# EAGLE design dust_environment_sensor (EAGLE 6.4)
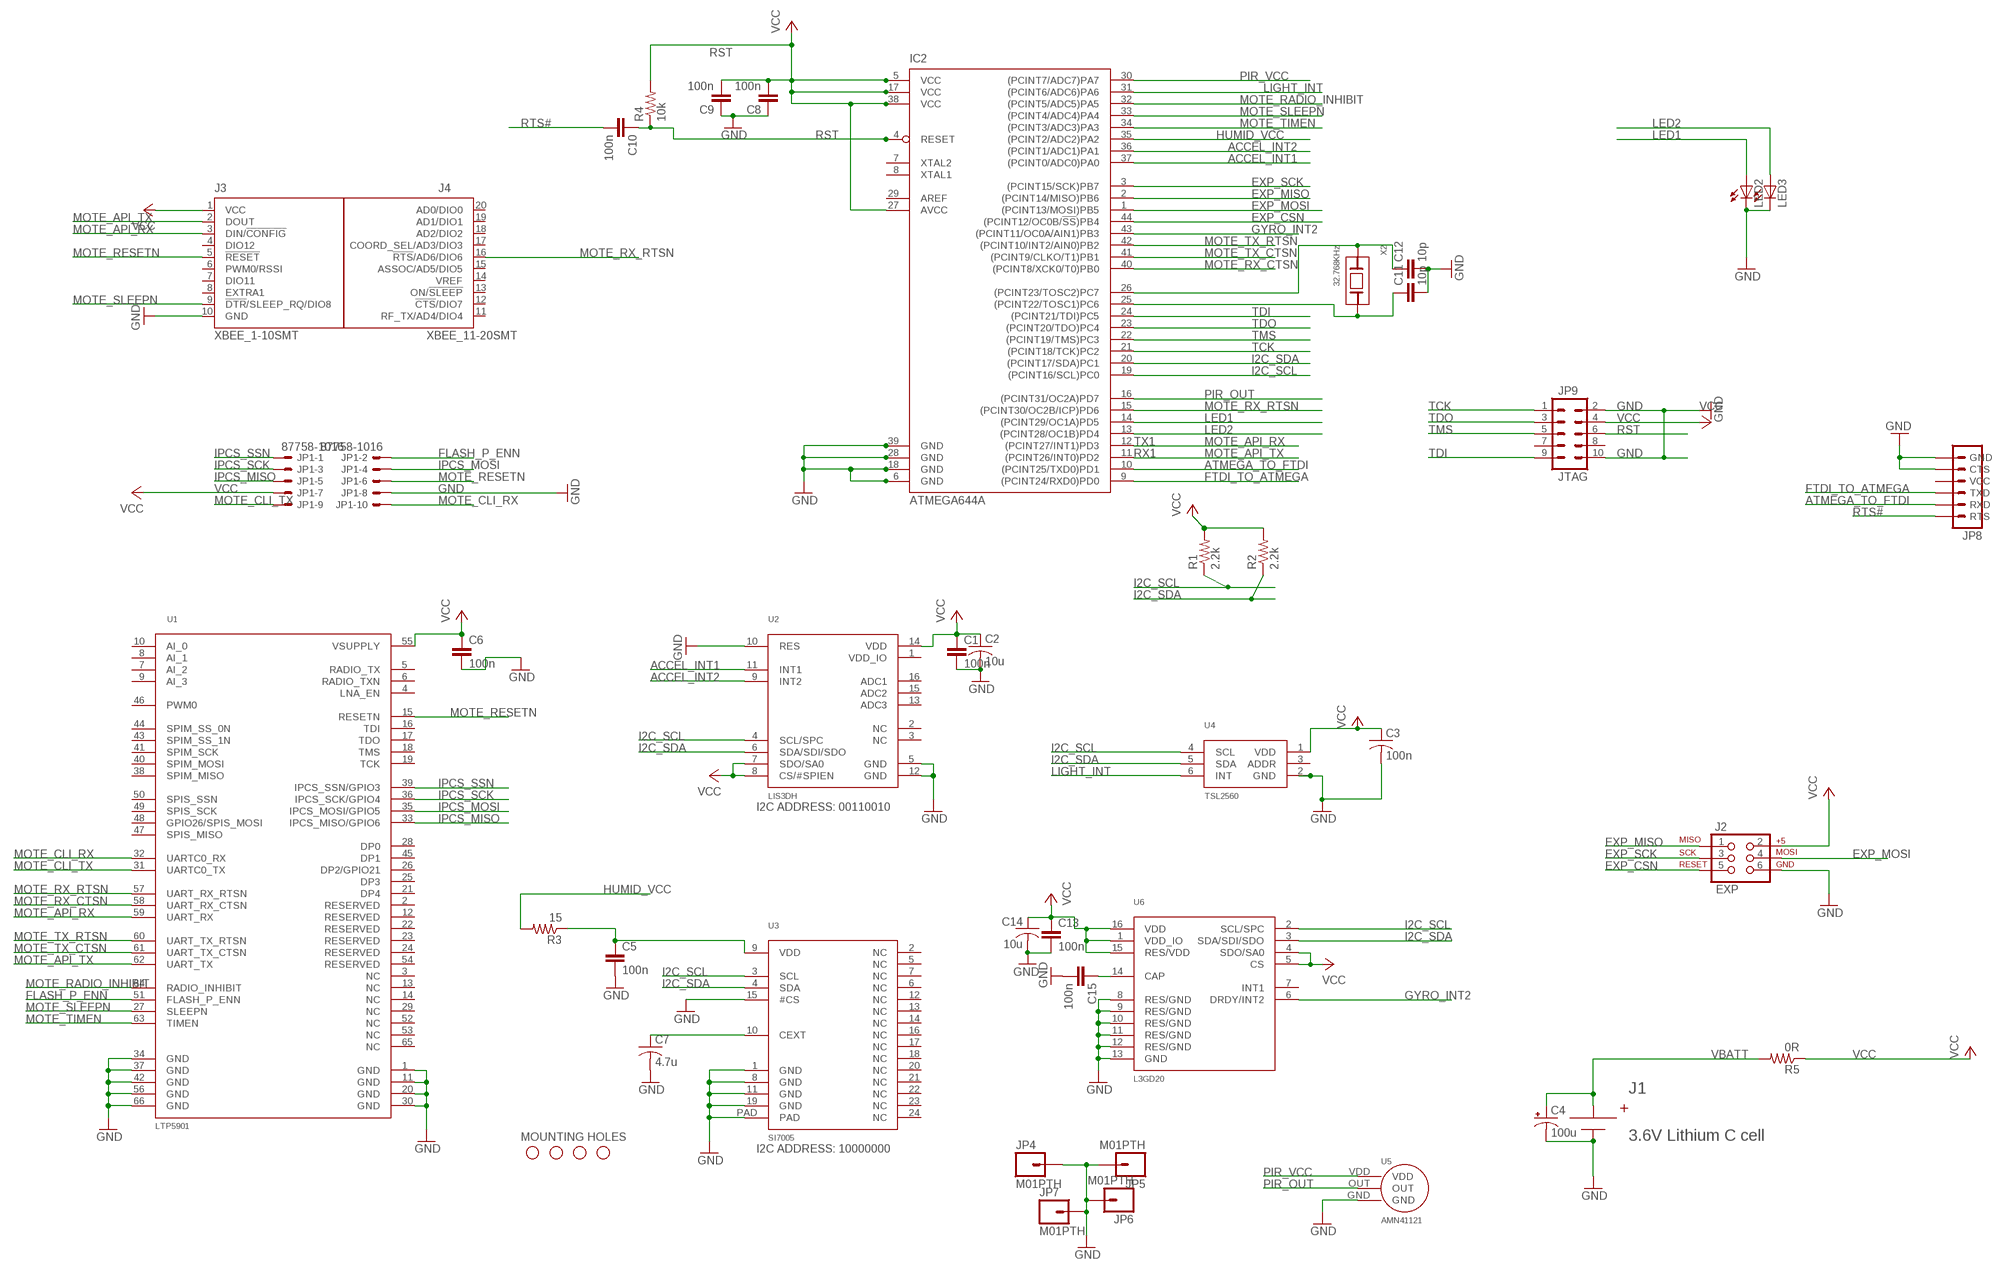
[diagram p0: schematic, sheet 1]

## Parts
C1  100n  C-EUC0603  [C0603]
C2  10u  C-USC0603  [C0603]
C3  100n  C-USC0603  [C0603]
C4  100u  CAP_POL1206-KIT  [EIA3216-KIT]
C5  100n  C-EUC0603  [C0603]
C6  100n  C-EUC0603  [C0603]
C7  4.7u  C-USC0603  [C0603]
C8  100n  C-EUC0603  [C0603]
C9  100n  C-EUC0603  [C0603]
C10  100n  C-EUC0603  [C0603]
C11  10p  C-EUC0603  [C0603]
C12  10p  C-EUC0603  [C0603]
C13  100n  C-EUC0603  [C0603]
C14  10u  C-USC0603  [C0603]
C15  100n  C-EUC0603  [C0603]
IC2  ATMEGA644A  [TQFP44]
J1  3.6V Lithium C cell  BX0036  [BX0036]
J2  EXP  AVR_SPI_PRG_6PTH  [2X3]
J3  XBEE_1-10SMT  [XBEE_1-10_SMT]
J4  XBEE_11-20SMT  [XBEE_11-20_SMT]
JP1  87758-1016  [87758-1016]
JP4  M01PTH  [1X01]
JP5  M01PTH  [1X01]
JP6  M01PTH  [1X01]
JP7  M01PTH  [1X01]
JP8  FTDI_CABLESIP  [1X06]
JP9  JTAG  M05X2PTH  [AVR_ICSP]
LED2  LEDCHIPLED_0805  [CHIPLED_0805]
LED3  LEDCHIPLED_0805  [CHIPLED_0805]
R1  2.2k  R-US_R0603  [R0603]
R2  2.2k  R-US_R0603  [R0603]
R3  15  R-US_R0603  [R0603]
R4  10k  R-US_R0603  [R0603]
R5  0R  R-US_R0603  [R0603]
STANDOFF1  STAND-OFF  [STAND-OFF]
STANDOFF2  STAND-OFF  [STAND-OFF]
STANDOFF3  STAND-OFF  [STAND-OFF]
STANDOFF4  STAND-OFF  [STAND-OFF]
U1  LTP5901  [LTP5901_MODULE]
U2  LIS3DH  [LGA16_ST]
U3  SI7005  [QFN24_SILICON_LABS]
U4  TSL2560  [CL6_TAOS]
U5  AMN41121  [AMN41121]
U6  L3GD20  [LGA16_4X4_ST]
X2  32.768KHz  XTALABS07  [ABS07]

## Nets
ACCEL_INT1: IC2.37((PCINT0/ADC0)PA0) U2.11(INT1)
ACCEL_INT2: IC2.36((PCINT1/ADC1)PA1) U2.9(INT2)
ATMEGA_TO_FTDI: IC2.10((PCINT25/TXD0)PD1) JP8.5(RXD)
EXP_CSN: IC2.44((PCINT12/OC0B/!SS!)PB4) J2.5
EXP_MISO: IC2.2((PCINT14/MISO)PB6) J2.1
EXP_MOSI: IC2.1((PCINT13/MOSI)PB5) J2.4
EXP_SCK: IC2.3((PCINT15/SCK)PB7) J2.3
FLASH_P_ENN: JP1.2 U1.51(FLASH_P_ENN)
FTDI_TO_ATMEGA: IC2.9((PCINT24/RXD0)PD0) JP8.4(TXD)
GND: C1.2 C2.2 C3.2 C4.C(-) C5.2 C6.2 C7.2 C8.1 C9.1 C11.2 C12.2 C13.2 C14.2 C15.2 IC2.6(GND) IC2.18(GND) IC2.28(GND) IC2.39(GND) J1.NEG J2.6 J3.10(GND) JP1.8 JP4.1 JP5.1 JP6.1 JP7.1 JP8.1(GND) JP8.2(CTS) JP9.2 JP9.10 LED2.C LED3.C U1.1(GND) U1.11(GND) U1.20(GND) U1.30(GND) U1.34(GND) U1.37(GND) U1.42(GND) U1.56(GND) U1.66(GND) U2.5(GND) U2.10(RES) U2.12(GND) U3.1(GND) U3.8(GND) U3.11(GND) U3.15(#CS) U3.19(GND) U3.PAD U4.2(GND) U5.GND U6.8(RES/GND) U6.9(RES/GND) U6.10(RES/GND) U6.11(RES/GND) U6.12(RES/GND) U6.13(GND)
GYRO_INT2: IC2.43((PCINT11/OC0A/AIN1)PB3) U6.6(DRDY/INT2)
HUMID_VCC: IC2.35((PCINT2/ADC2)PA2) R3.2
I2C_SCL: IC2.19((PCINT16/SCL)PC0) R1.1 U2.4(SCL/SPC) U3.3(SCL) U4.4(SCL) U6.2(SCL/SPC)
I2C_SDA: IC2.20((PCINT17/SDA)PC1) R2.1 U2.6(SDA/SDI/SDO) U3.4(SDA) U4.5(SDA) U6.3(SDA/SDI/SDO)
IPCS_MISO: JP1.5 U1.33(IPCS_MISO/GPIO6)
IPCS_MOSI: JP1.4 U1.35(IPCS_MOSI/GPIO5)
IPCS_SCK: JP1.3 U1.36(IPCS_SCK/GPIO4)
IPCS_SSN: JP1.1 U1.39(IPCS_SSN/GPIO3)
LED1: IC2.14((PCINT29/OC1A)PD5) LED2.A
LED2: IC2.13((PCINT28/OC1B)PD4) LED3.A
LIGHT_INT: IC2.31((PCINT6/ADC6)PA6) U4.6(INT)
MOTE_API_RX: IC2.12((PCINT27/INT1)PD3) J3.3(DIN/!CONFIG) U1.59(UART_RX)
MOTE_API_TX: IC2.11((PCINT26/INT0)PD2) J3.2(DOUT) U1.62(UART_TX)
MOTE_CLI_RX: JP1.10 U1.32(UARTC0_RX)
MOTE_CLI_TX: JP1.9 U1.31(UARTC0_TX)
MOTE_RADIO_INHIBIT: IC2.32((PCINT5/ADC5)PA5) U1.64(RADIO_INHIBIT)
MOTE_RESETN: J3.5(!RESET) JP1.6 U1.15(RESETN)
MOTE_RX_CTSN: IC2.40((PCINT8/XCK0/T0)PB0) U1.58(UART_RX_CTSN)
MOTE_RX_RTSN: IC2.15((PCINT30/OC2B/ICP)PD6) J4.16(!RTS!/AD6/DIO6) U1.57(UART_RX_RTSN)
MOTE_SLEEPN: IC2.33((PCINT4/ADC4)PA4) J3.9(!DTR!/SLEEP_RQ/DIO8) U1.27(SLEEPN)
MOTE_TIMEN: IC2.34((PCINT3/ADC3)PA3) U1.63(TIMEN)
MOTE_TX_CTSN: IC2.41((PCINT9/CLKO/T1)PB1) U1.61(UART_TX_CTSN)
MOTE_TX_RTSN: IC2.42((PCINT10/INT2/AIN0)PB2) U1.60(UART_TX_RTSN)
N$1: C7.1 U3.10(CEXT)
N$2: C15.1 U6.14(CAP)
N$3: C5.1 R3.1 U3.9(VDD)
N$6: C11.1 IC2.25((PCINT22/TOSC1)PC6) X2.2(B)
N$7: C12.1 IC2.26((PCINT23/TOSC2)PC7) X2.1(A)
PIR_OUT: IC2.16((PCINT31/OC2A)PD7) U5.OUT
PIR_VCC: IC2.30((PCINT7/ADC7)PA7) U5.VDD
RST: C10.1 IC2.4(RESET) JP9.6 R4.1
RTS#: C10.2 JP8.6(RTS)
TCK: IC2.21((PCINT18/TCK)PC2) JP9.1
TDI: IC2.24((PCINT21/TDI)PC5) JP9.9
TDO: IC2.23((PCINT20/TDO)PC4) JP9.3
TMS: IC2.22((PCINT19/TMS)PC3) JP9.5
VBATT: C4.A(+) J1.POS R5.2
VCC: C1.1 C2.1 C3.1 C6.1 C8.2 C9.2 C13.1 C14.1 IC2.5(VCC) IC2.17(VCC) IC2.27(AVCC) IC2.38(VCC) J2.2 J3.1(VCC) JP1.7 JP9.4 R1.2 R2.2 R4.2 R5.1 U1.55(VSUPPLY) U2.7(SDO/SA0) U2.8(CS/#SPIEN) U2.14(VDD) U4.1(VDD) U6.1(VDD_IO) U6.4(SDO/SA0) U6.5(CS) U6.15(RES/VDD) U6.16(VDD)
Unconnected: IC2.7(XTAL2) IC2.8(XTAL1) IC2.29(AREF) J3.4(DIO12) J3.6(PWM0/RSSI) J3.7(DIO11) J3.8(EXTRA1) J4.11(RF_TX/AD4/DIO4) J4.12(!CTS!/DIO7) J4.13(ON/!SLEEP) J4.14(VREF) J4.15(ASSOC/AD5/DIO5) J4.17(COORD_SEL/AD3/DIO3) J4.18(AD2/DIO2) J4.19(AD1/DIO1) J4.20(AD0/DIO0) JP8.3(VCC) JP9.7 JP9.8 U1.2(RESERVED) U1.3(NC) U1.4(LNA_EN) U1.5(RADIO_TX) U1.6(RADIO_TXN) U1.7(AI_2) U1.8(AI_1) U1.9(AI_3) U1.10(AI_0) U1.12(RESERVED) U1.13(NC) U1.14(NC) U1.16(TDI) U1.17(TDO) U1.18(TMS) U1.19(TCK) U1.21(DP4) U1.22(RESERVED) U1.23(RESERVED) U1.24(RESERVED) U1.25(DP3) U1.26(DP2/GPIO21) U1.28(DP0) U1.29(NC) U1.38(SPIM_MISO) U1.40(SPIM_MOSI) U1.41(SPIM_SCK) U1.43(SPIM_SS_1N) U1.44(SPIM_SS_0N) U1.45(DP1) U1.46(PWM0) U1.47(SPIS_MISO) U1.48(GPIO26/SPIS_MOSI) U1.49(SPIS_SCK) U1.50(SPIS_SSN) U1.52(NC) U1.53(NC) U1.54(RESERVED) U1.65(NC) U2.1(VDD_IO) U2.2(NC) U2.3(NC) U2.13(ADC3) U2.15(ADC2) U2.16(ADC1) U3.2(NC) U3.5(NC) U3.6(NC) U3.7(NC) U3.12(NC) U3.13(NC) U3.14(NC) U3.16(NC) U3.17(NC) U3.18(NC) U3.20(NC) U3.21(NC) U3.22(NC) U3.23(NC) U3.24(NC) U4.3(ADDR) U6.7(INT1)

## Notes on the sheet
- TX1
- RX1
- I2C ADDRESS: 00110010
- MOUNTING HOLES
- I2C ADDRESS: 10000000

## Library data of the parts
C1 C5 C6 C8-C13 C15 = rcl:C-EU: CAPACITOR, European symbol
C2 C3 C7 C14 = rcl:C-US: CAPACITOR, American symbol
C4 = SparkFun-Capacitors:CAP_POL: Capacitor Polarized These are standard SMD and PTH capacitors. Normally 10uF, 47uF, and 100uF in electrolytic and tantalum varieties. Always verify the external diameter of the through hole cap, it varies with capacity, voltage, and manufacturer. The EIA devices should be standard.
IC2 = atmel:ATMEGA644: 8-bit Microcontroller with 64K Bytes In-System Programmable Flash Source: http://www.atmel.com/dyn/resources/prod_documents/doc2593.pdf; MPN: ATMEGA644PV-10AU; OC_FARNELL: 1455123; OC_NEWARK: 58M3748
J1 = Cool_Electricity:BX0036: BX0036 C-cell battery holder
J2 = SparkFun-Connectors:AVR_SPI_PRG_6: AVR ISP 6 Pin This is the reduced ISP connector for AVR programming. Common on Arduino. This footprint will take up less PCB space and can be used with a 10-pin to 6-pin adapter such as SKU: BOB-08508
J3 = Cool_Electricity:XBEE_1-10
J4 = Cool_Electricity:XBEE_11-20
JP1 = con-molex:87758-1016: 10 Pin - 2mm Dual Row Single Wafer, Vertical T/H HDR Source: http://www.molex.com/pdm_docs/sd/877580616_sd.pdf; MF: MOLEX; MPN: 87758-1016; OC_FARNELL: 7472340; OC_NEWARK: 59J1558
JP4-JP7 = SparkFun-Connectors:M01: Header 1 Standard 1-pin 0.1" header. Use with straight break away headers (SKU : PRT-00116), right angle break away headers (PRT-00553), swiss pins (PRT-00743), machine pins (PRT-00117), and female headers (PRT-00115).
JP8 = custom:FTDI_CABLE: Header 6 Standard 6-pin 0.1" header. Use with straight break away headers (SKU : PRT-00116), right angle break away headers (PRT-00553), swiss pins (PRT-00743), machine pins (PRT-00117), and female headers (PRT-00115). Molex polarized connector foot print use with SKU : PRT-08094 with associated crimp pins and housings. NOTES ON THE VARIANTS LOCK and LOCK_LONGPADS... This footprint was designed to help hold the alignment of a through-hole component (i.e. 6-pin header) while soldering it into place. You may notice that each hole has been shifted either up or down by 0.005 of an inch from it's more standard position (which is a perfectly straight line). This slight alteration caused the pins (the squares in the middle) to touch the edges of the holes. Because they are alternating, it causes a "brace" to hold the component in place. 0.005 has proven to be the perfect amount of "off-center" position when using our standard breakaway headers. Although looks a little odd when you look at the bare footprint, once you have a header in there, the alteration is very hard to notice. Also, if you push a header all the way into place, it is covered up entirely on the bottom side. This idea of altering the position of holes to aid alignment will be further integrated into the Sparkfun Library for other footprints. It can help hold any component with 3 or more connection pins.
JP9 = SparkFun-Connectors:M05X2: Header 5x2 Standard 10-pin dual row 0.1" header. Commonly used with AVR-ISP. Use with Spark Fun Electronics SKU: PRT-00778
LED2 LED3 = led:LED: LED OSRAM: - CHIPLED LG R971, LG N971, LY N971, LG Q971, LY Q971, LO R971, LY R971 LH N974, LH R974 LS Q976, LO Q976, LY Q976 LO Q996 - Hyper CHIPLED LW Q18S LB Q993, LB Q99A, LB R99A - SideLED LS A670, LO A670, LY A670, LG A670, LP A670 LB A673, LV A673, LT A673, LW A673 LH A674 LY A675 LS A676, LA A676, LO A676, LY A676, LW A676 LS A679, LY A679, LG A679 - Hyper Micro SIDELED® LS Y876, LA Y876, LO Y876, LY Y876 LT Y87S - SmartLED LW L88C, LW L88S LB L89C, LB L89S, LG L890 LS L89K, LO L89K, LY L89K LS L896, LA L896, LO L896, LY L896 - TOPLED LS T670, LO T670, LY T670, LG T670, LP T670 LSG T670, LSP T670, LSY T670, LOP T670, LYG T670 LG T671, LOG T671, LSG T671 LB T673, LV T673, LT T673, LW T673 LH T674 LS T676, LA T676, LO T676, LY T676, LB T676, LH T676, LSB T676, LW T676 LB T67C, LV T67C, LT T67C, LS T67K, LO T67K, LY T67K, LW E67C LS E67B, LA E67B, LO E67B, LY E67B, LB E67C, LV E67C, LT E67C LW T67C LS T679, LY T679, LG T679 LS T770, LO T770, LY T770, LG T770, LP T770 LB T773, LV T773, LT T773, LW T773 LH T774 LS E675, LA E675, LY E675, LS T675 LS T776, LA T776, LO T776, LY T776, LB T776 LHGB T686 LT T68C, LB T68C - Hyper Mini TOPLED® LB M676 - Mini TOPLED Santana® LG M470 LS M47K, LO M47K, LY M47K Source: http://www.osram.convergy.de LUXEON: - LUMILED® LXK2-PW12-R00, LXK2-PW12-S00, LXK2-PW14-U00, LXK2-PW14-V00 LXK2-PM12-R00, LXK2-PM12-S00, LXK2-PM14-U00 LXK2-PE12-Q00, LXK2-PE12-R00, LXK2-PE12-S00, LXK2-PE14-T00, LXK2-PE14-U00 LXK2-PB12-K00, LXK2-PB12-L00, LXK2-PB12-M00, LXK2-PB14-N00, LXK2-PB14-P00, LXK2-PB14-Q00 LXK2-PR12-L00, LXK2-PR12-M00, LXK2-PR14-Q00, LXK2-PR14-R00 LXK2-PD12-Q00, LXK2-PD12-R00, LXK2-PD12-S00 LXK2-PH12-R00, LXK2-PH12-S00 LXK2-PL12-P00, LXK2-PL12-Q00, LXK2-PL12-R00 Source: www.luxeon.com KINGBRIGHT: KA-3528ASYC Source: www.kingbright.com
R1-R5 = resistor:R-US_: RESISTOR, American symbol
STANDOFF1-STANDOFF4 = SparkFun-Electromechanical:STAND-OFF: #4 Stand Off This is the mechanical footprint for a #4 phillips button head screw. Use the keepout ring to avoid running the screw head into surrounding components. SKU : PRT-00447
U1 = Cool_Electricity:LTP5901: LTP5901
U2 = Cool_Electricity:LIS3DH: LIS3DH 3-axis accellerometer
U3 = Cool_Electricity:SI7005: Silicon Labs Si7005 Temperature and Humidity Sensor
U4 = Cool_Electricity:TSL2560: TSL2560 Ambient Light Sensor
U5 = Cool_Electricity:AMN41121
U6 = Cool_Electricity:L3GD20
X2 = WSNlib:XTAL: Crystals used in OpenMote

## Net classes
0 default: width 0.254 mm, drill 0.33 mm, clearance 0.152 mm
1 power: width 0.254 mm, drill 0.33 mm, clearance 0.152 mm

## Board
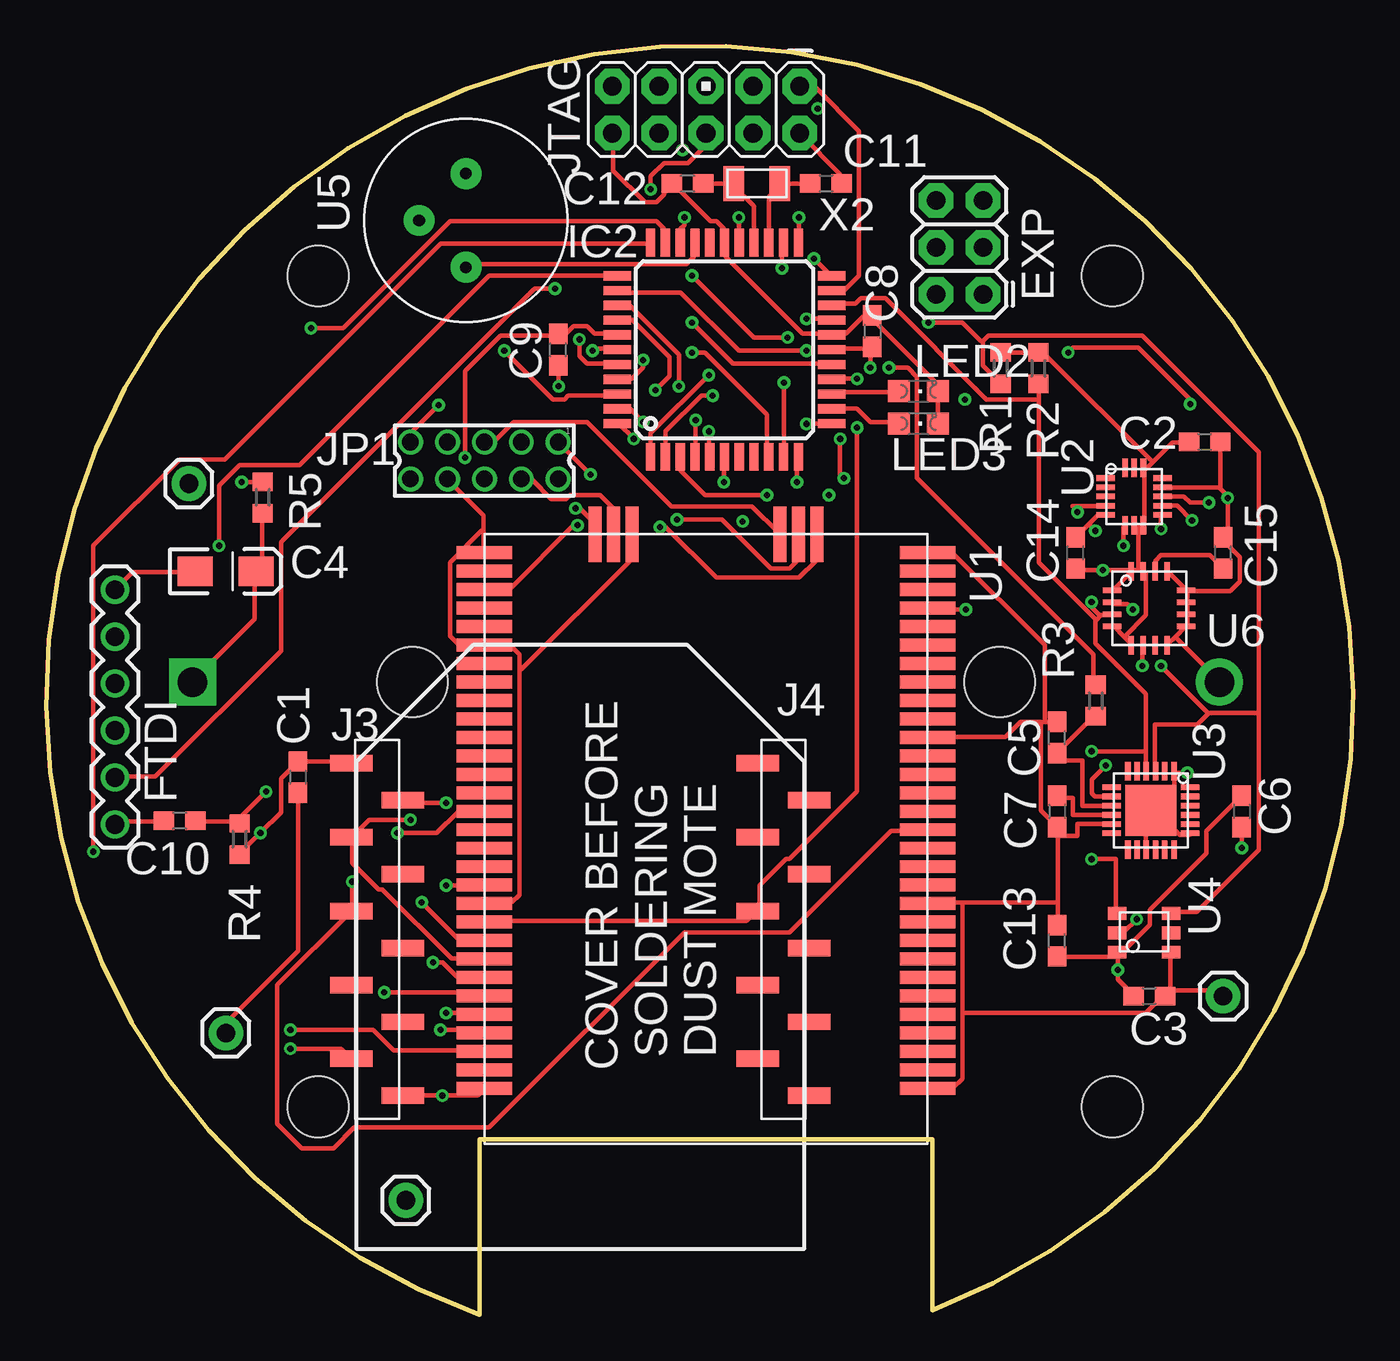
[diagram p1: board, top side]
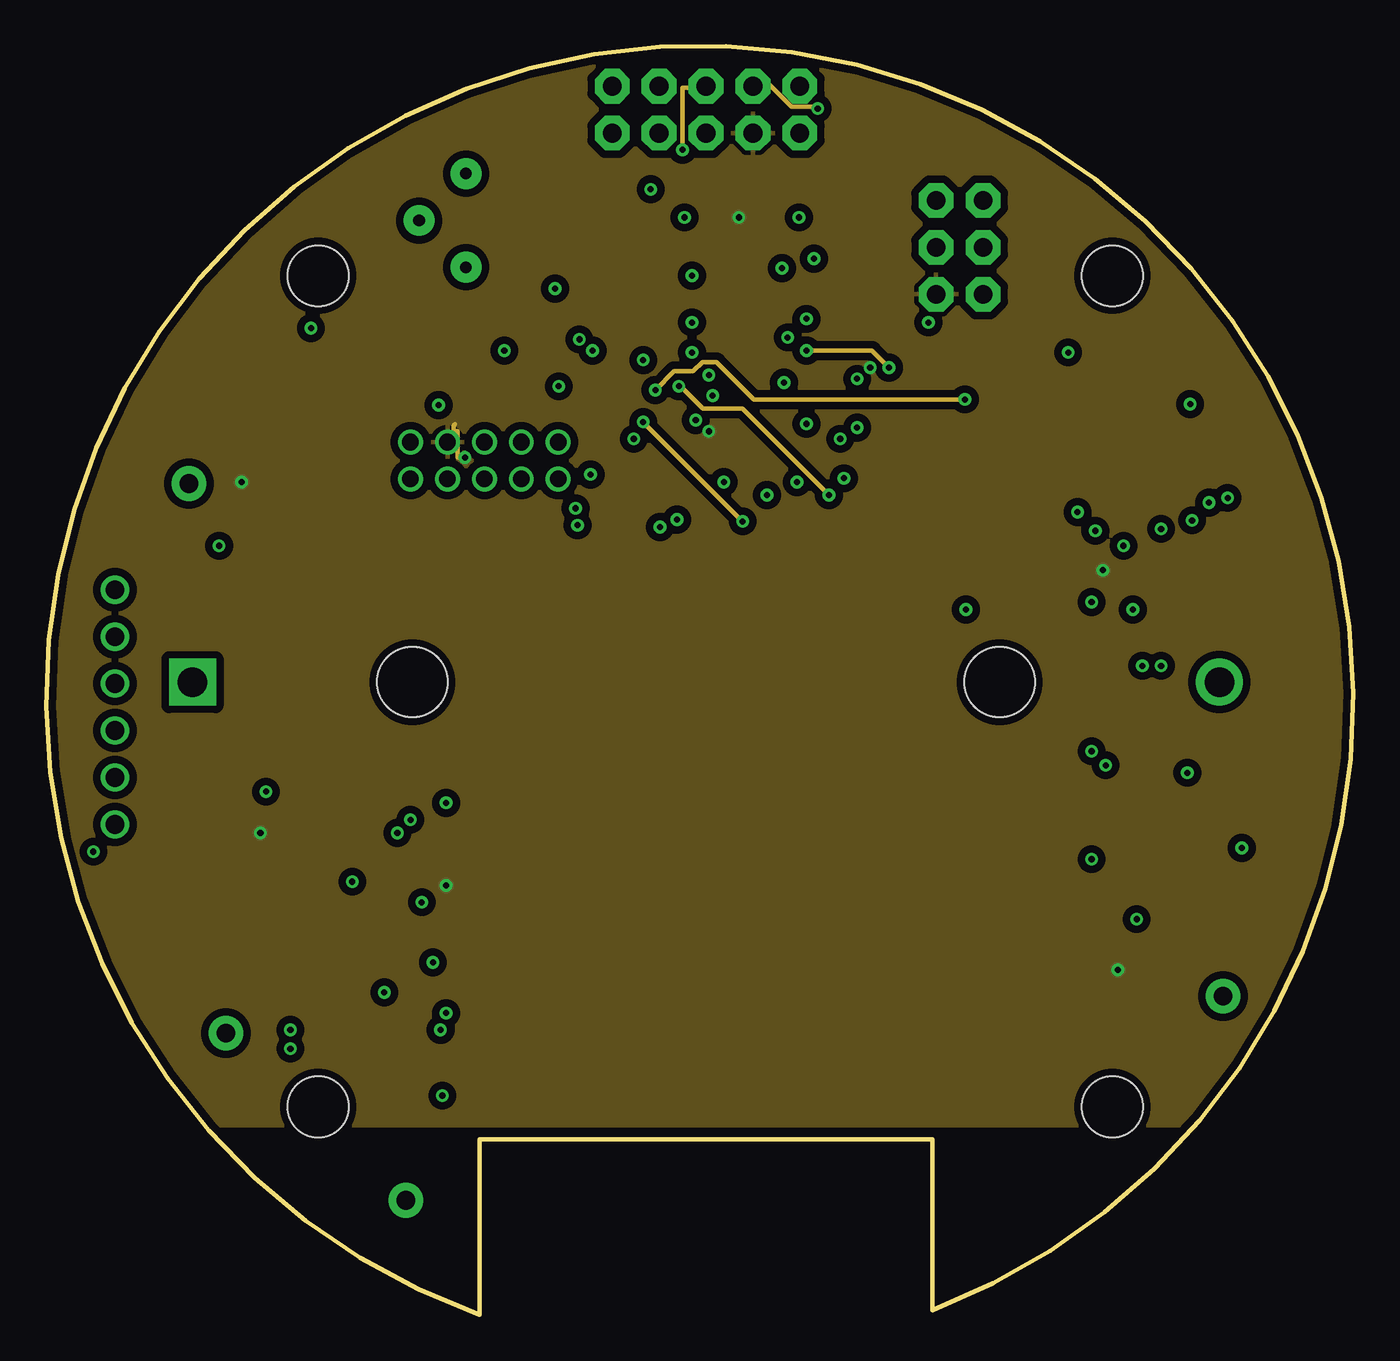
[diagram p2: board, inner layer VCC]
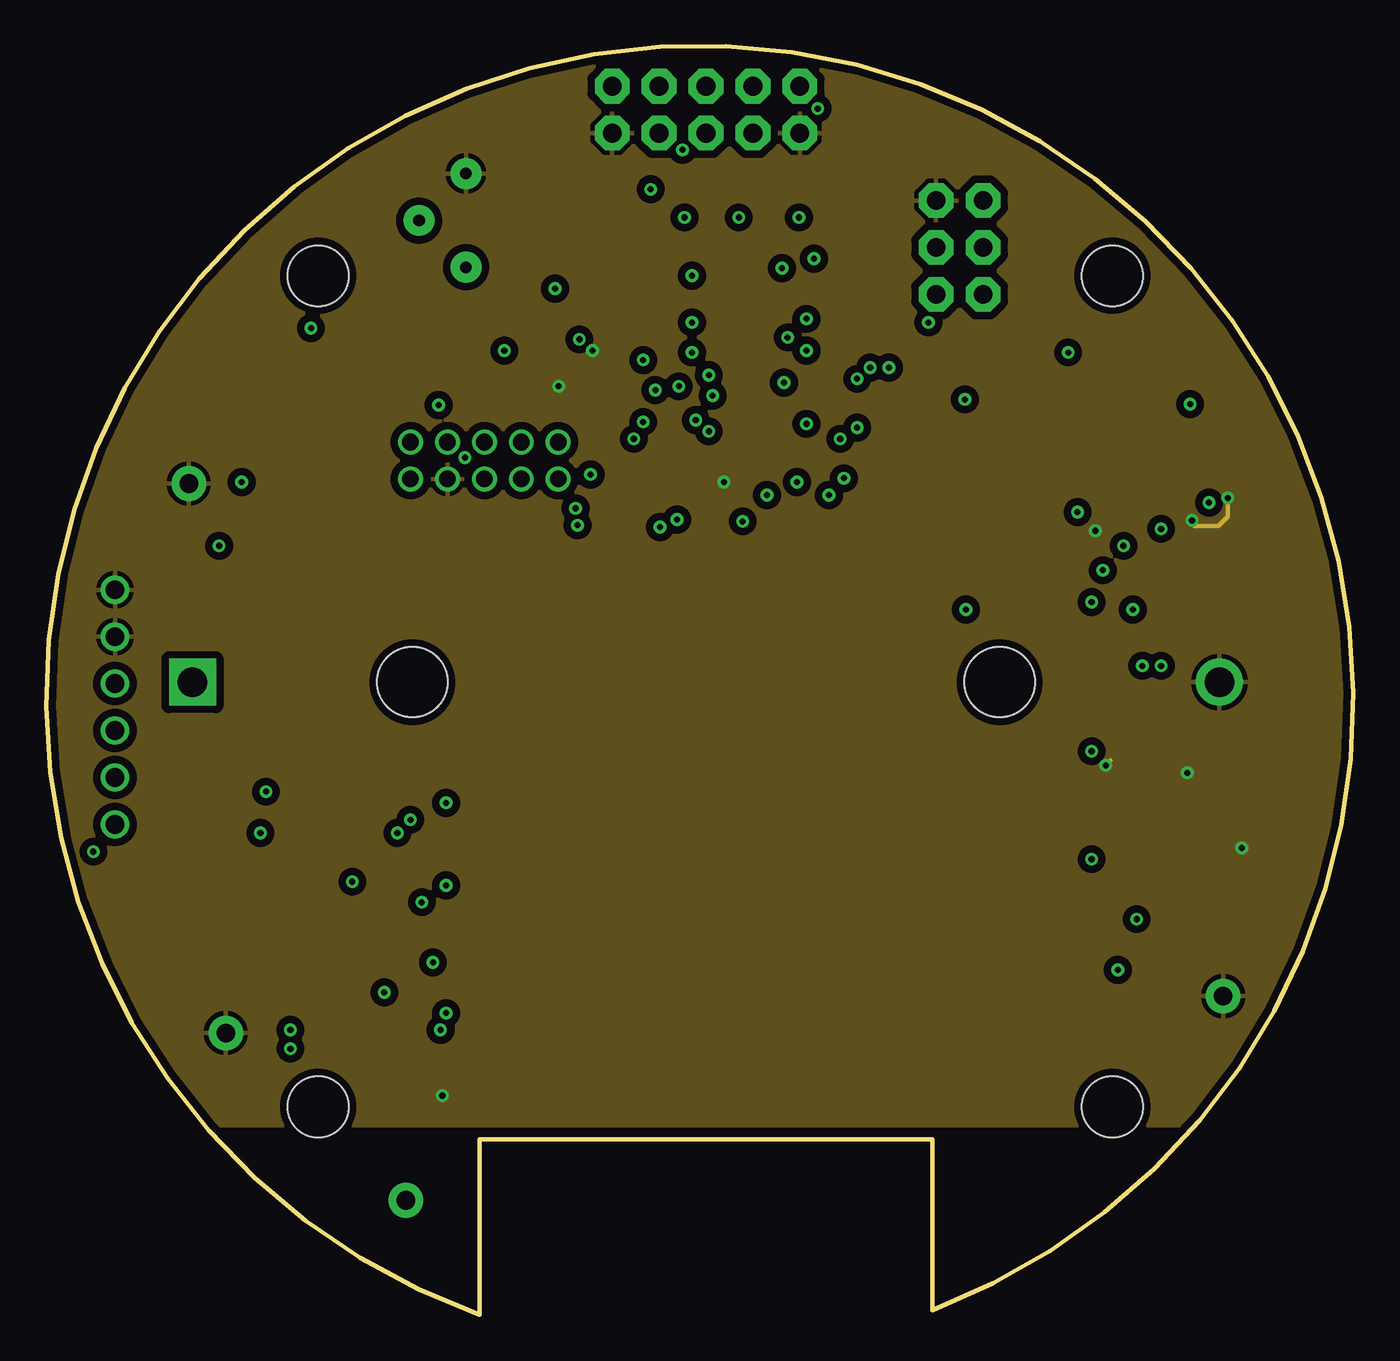
[diagram p3: board, inner layer GND]
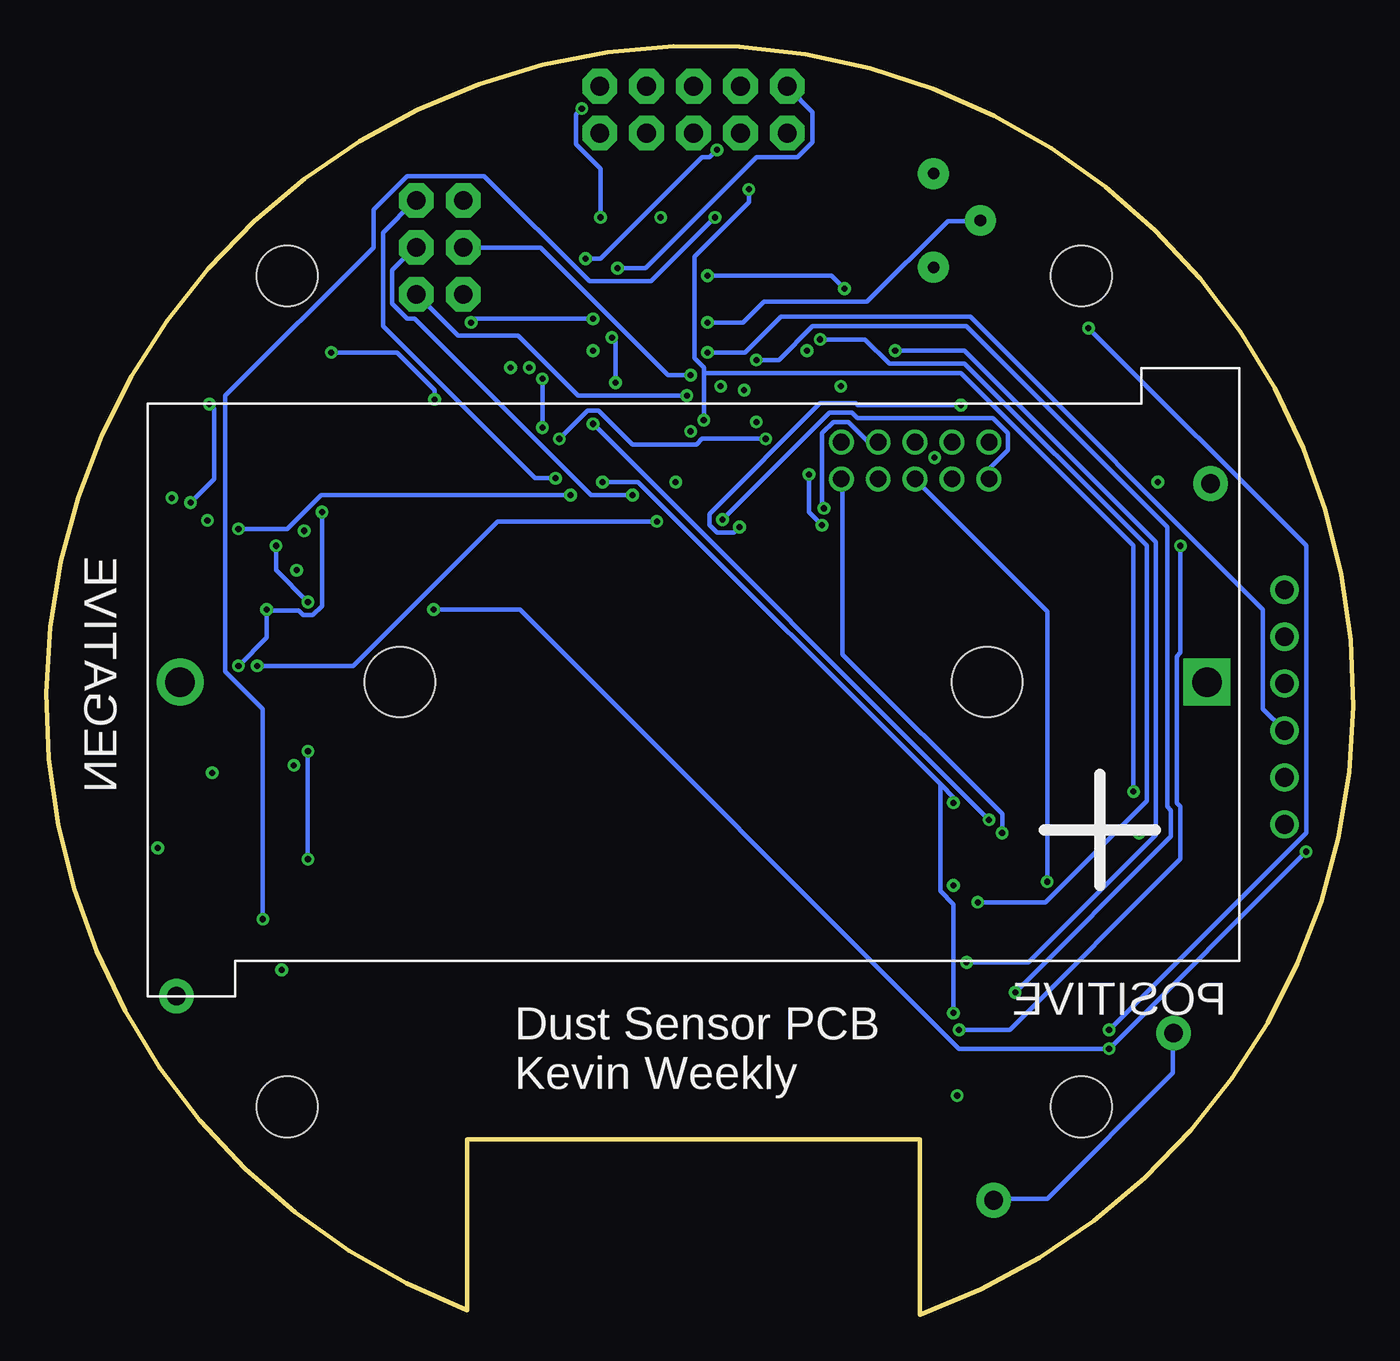
[diagram p4: board, bottom side, seen from below]

Size 70.78 x 68.69 mm. Coordinates in mm from the lower left corner, seen from the top.
Outline: 23.48,0 arc-319 47.98,0.25 47.98,9.5 23.48,9.5 23.48,0
Copper layers (1+2*15+16): Top 0.0356mm / dielectric 0.2007mm / VCC 0.017mm / dielectric 1.5mm / GND 0.017mm / dielectric 0.2007mm / Bottom 0.0356mm
Design rules "LaenPCBOrder_4LAYER": minimum track width 6mil, minimum drill 13mil, track to track 6mil, track to pad 6mil, pad to pad 6mil, via to via 6mil, smd to smd 6mil, copper to edge 15mil, drill to drill 6mil, minimum pad ring 7mil, minimum via ring 7mil, stop-mask expansion 4mil, vias tented up to drill 0mil, thermal gap 10mil

### Footprints (pad centres in the part's own frame; a part is rotated, then mirrored left to right if it is on the bottom)
C0603 = smd 1.1 x 1: 1 -0.85,0; 2 0.85,0
EIA3216-KIT = smd 1.9 x 1.6: A 1.65,0; C -1.65,0
TQFP44 = smd 1.5 x 0.5: 1 -5.8,4; 2 -5.8,3.2; 3 -5.8,2.4; 4 -5.8,1.6; 5 -5.8,0.8; 6 -5.8,0; 7 -5.8,-0.8; 8 -5.8,-1.6; 9 -5.8,-2.4; 10 -5.8,-3.2; 11 -5.8,-4; 23 5.8,-4; 24 5.8,-3.2; 25 5.8,-2.4; 26 5.8,-1.6; 27 5.8,-0.8; 28 5.8,0; 29 5.8,0.8; 30 5.8,1.6; 31 5.8,2.4; 32 5.8,3.2; 33 5.8,4 | smd 0.5 x 1.5: 12 -4,-5.8; 13 -3.2,-5.8; 14 -2.4,-5.8; 15 -1.6,-5.8; 16 -0.8,-5.8; 17 0,-5.8; 18 0.8,-5.8; 19 1.6,-5.8; 20 2.4,-5.8; 21 3.2,-5.8; 22 4,-5.8; 34 4,5.8; 35 3.2,5.8; 36 2.4,5.8; 37 1.6,5.8; 38 0.8,5.8; 39 0,5.8; 40 -0.8,5.8; 41 -1.6,5.8; 42 -2.4,5.8; 43 -3.2,5.8; 44 -4,5.8
BX0036 = drill 1.6 pad 2.54: NEG 27.8,0 | drill 1.6 pad 2.54 square: POS -27.8,0 | hole 3.8: 15.9,0; -15.9,0
2X3 = drill 1.016 pad 1.88 octagon: 1 0,0; 2 0,2.54; 3 2.54,0; 4 2.54,2.54; 5 5.08,0; 6 5.08,2.54
XBEE_1-10_SMT = smd 2.29 x 0.89: 1 -12.395,9; 2 -9.605,7; 3 -12.395,5; 4 -9.605,3; 5 -12.395,1; 6 -9.605,-1; 7 -12.395,-3; 8 -9.605,-5; 9 -12.395,-7; 10 -9.605,-9
XBEE_11-20_SMT = smd 2.29 x 0.89: 11 12.395,-9; 12 9.605,-7; 13 12.395,-5; 14 9.605,-3; 15 12.395,-1; 16 9.605,1; 17 12.395,3; 18 9.605,5; 19 12.395,7; 20 9.605,9
87758-1016 = drill 0.9 pad 1.27: 1 -4,-1; 2 -4,1; 3 -2,-1; 4 -2,1; 5 0,-1; 6 0,1; 7 2,-1; 8 2,1; 9 4,-1; 10 4,1
1X01 = drill 1.016 pad 1.88: 1 0,0
1X06 = drill 1.016: 1 0,0; 2 2.54,0; 3 5.08,0; 4 7.62,0; 5 10.16,0; 6 12.7,0
AVR_ICSP = drill 1.016 pad 1.88 octagon: 1 -1.27,5.08; 2 1.27,5.08; 3 -1.27,2.54; 4 1.27,2.54; 5 -1.27,0; 6 1.27,0; 7 -1.27,-2.54; 8 1.27,-2.54; 9 -1.27,-5.08; 10 1.27,-5.08
CHIPLED_0805 = smd 1.2 x 1.2: A 0,-1.05; C 0,1.05
R0603 = smd 1 x 1.1: 1 -0.85,0; 2 0.85,0
STAND-OFF = hole 3.302: 0,0
LTP5901_MODULE = smd 3 x 0.7: 1 -12,13.5; 2 -12,12.5; 3 -12,11.5; 4 -12,10.5; 5 -12,9.5; 6 -12,8.5; 7 -12,7.5; 8 -12,6.5; 9 -12,5.5; 10 -12,4.5; 11 -12,3.5; 12 -12,2.5; 13 -12,1.5; 14 -12,0.5; 15 -12,-0.5; 16 -12,-1.5; 17 -12,-2.5; 18 -12,-3.5; 19 -12,-4.5; 20 -12,-5.5; 21 -12,-6.5; 22 -12,-7.5; 23 -12,-8.5; 24 -12,-9.5; 25 -12,-10.5; 26 -12,-11.5; 27 -12,-12.5; 28 -12,-13.5; 29 -12,-14.5; 30 -12,-15.5; 37 12,-15.5; 38 12,-14.5; 39 12,-13.5; 40 12,-12.5; 41 12,-11.5; 42 12,-10.5; 43 12,-9.5; 44 12,-8.5; 45 12,-7.5; 46 12,-6.5; 47 12,-5.5; 48 12,-4.5; 49 12,-3.5; 50 12,-2.5; 51 12,-1.5; 52 12,-0.5; 53 12,0.5; 54 12,1.5; 55 12,2.5; 56 12,3.5; 57 12,4.5; 58 12,5.5; 59 12,6.5; 60 12,7.5; 61 12,8.5; 62 12,9.5; 63 12,10.5; 64 12,11.5; 65 12,12.5; 66 12,13.5 | smd 0.7 x 3: 31 -6,-16.5; 32 -5,-16.5; 33 -4,-16.5; 34 4,-16.5; 35 5,-16.5; 36 6,-16.5
LGA16_ST = smd 1 x 0.3: 1 -1.55,1; 2 -1.55,0.5; 3 -1.55,0; 4 -1.55,-0.5; 5 -1.55,-1; 9 1.55,-1; 10 1.55,-0.5; 11 1.55,0; 12 1.55,0.5; 13 1.55,1 | smd 0.3 x 1: 6 -0.5,-1.55; 7 0,-1.55; 8 0.5,-1.55; 14 0.5,1.55; 15 0,1.55; 16 -0.5,1.55
QFN24_SILICON_LABS = smd 1 x 0.3: 1 -2.125,1.25; 2 -2.125,0.75; 3 -2.125,0.25; 4 -2.125,-0.25; 5 -2.125,-0.75; 6 -2.125,-1.25; 13 2.125,-1.25; 14 2.125,-0.75; 15 2.125,-0.25; 16 2.125,0.25; 17 2.125,0.75; 18 2.125,1.25 | smd 0.3 x 1: 7 -1.25,-2.125; 8 -0.75,-2.125; 9 -0.25,-2.125; 10 0.25,-2.125; 11 0.75,-2.125; 12 1.25,-2.125; 19 1.25,2.125; 20 0.75,2.125; 21 0.25,2.125; 22 -0.25,2.125; 23 -0.75,2.125; 24 -1.25,2.125 | smd 2.75 x 2.75: PAD 0,0
CL6_TAOS = smd 1 x 0.7: 1 -1.45,-1.05; 2 1.45,-1.05; 3 1.45,0; 4 1.45,1.05; 5 -1.45,1.05; 6 -1.45,0
AMN41121 = drill 0.635 pad 1.676: GND 0,2.54; OUT -2.54,0; VDD 0,-2.54
LGA16_4X4_ST = smd 1 x 0.3: 1 -2,0.975; 2 -2,0.325; 3 -2,-0.325; 4 -2,-0.975; 9 2,-0.975; 10 2,-0.325; 11 2,0.325; 12 2,0.975 | smd 0.3 x 1: 5 -0.975,-2; 6 -0.325,-2; 7 0.325,-2; 8 0.975,-2; 13 0.975,2; 14 0.325,2; 15 -0.325,2; 16 -0.975,2
ABS07 = smd 1.1 x 1.9: 1 -1.25,0; 2 1.25,0

### Placement (x,y rotation side)
C1  13.63,29.11 270 top
C2  62.73,47.25 0 top
C3  59.73,17.25 0 top
C4  9.73,40.25 0 top
C5  54.73,31.25 90 top
C6  64.73,27.25 270 top
C7  54.73,27.25 270 top
C8  44.73,53.25 270 top
C9  27.73,52.25 90 top
C10  7.23,26.75 180 top
C11  TODO  [C0603]  42.23,61.25 0 top
C12  TODO  [C0603]  34.73,61.25 180 top
C13  54.73,20.25 90 top
C14  55.73,41.25 90 top
C15  63.73,41.25 90 top
IC2  36.73,52.25 90 top
J1  35.73,34.25 180 bottom
J2  50.73,55.25 90 top
J3  28.92,20.86 0 top
J4  28.92,20.86 0 top
JP1  23.73,46.25 180 top
JP4  63.73,17.25 0 top
JP5  19.47,6.19 0 top
JP6  7.73,45 0 top
JP7  9.73,15.25 0 top
JP8  3.73,39.25 270 top
JP9  35.73,65.25 270 top
LED2  47.23,50 270 top
LED3  47.23,48.25 270 top
R1  51.68,51.25 90 top
R2  53.73,51.25 90 top
R3  56.83,33.25 90 top
R4  10.48,25.75 270 top
R5  11.73,44.25 270 top
STANDOFF1  14.73,11.25 0 top
STANDOFF2  14.73,56.25 0 top
STANDOFF3  57.73,11.25 0 top
STANDOFF4  57.73,56.25 0 top
U1  35.73,25.76 180 top
U2  58.91,44.3 0 top
U3  59.82,27.31 270 top
U4  59.45,20.68 0 top
U5  22.73,59.25 0 top
U6  59.73,38.25 0 top
X2  38.48,61.25 0 top

### Tracks (layer width: path | path; a pad name or v marks a point on that pad's centre or on a via)
ACCEL_INT1  (via drill 0.33)
  Top 0.254: v61.94,49.3 61.94,49.56 59.15,52.35 55.59,52.35 v55.34,52.1 | v32.98,50.07 33.75,50.83 33.75,51.84 31.71,53.88 30.95,53.88 IC2.37 | v62.96,43.97 61.94,43.97 61.61,44.3 U2.11
  VCC 0.254: v49.75,49.56 38.32,49.56 36.29,51.59 35.52,51.59 35.02,51.08 34,51.08 v32.98,50.07
  Bottom 0.254: v62.96,43.97 61.69,45.24 61.69,49.05 v61.94,49.3 | v55.34,52.1 51.78,52.1 49.75,50.07 v49.75,49.56
ACCEL_INT2  (via drill 0.33)
  Top 0.254: v60.37,42.55 60.37,43.26 U2.9 | v34.25,50.27 34.25,52 31.61,54.64 31,54.64 IC2.36
  VCC 0.254: v42.38,44.38 37.71,49.05 35.58,49.05 34.36,50.27 v34.25,50.27
  Bottom 0.254: v60.37,42.55 57.72,42.55 55.9,44.38 v42.38,44.38
ATMEGA_TO_FTDI  (via drill 0.33)
  Top 0.254: v39.94,50.47 39.94,46.51 IC2.10 | v40.15,52.91 38.32,52.91 v34.97,56.26 | v27.55,55.55 26.43,55.55 12.72,41.84 12.72,35.94 5.91,29.14 3.77,29.14 JP8.5
  Bottom 0.254: v39.94,50.47 39.94,52.71 v40.15,52.91 | v34.97,56.26 28.26,56.26 v27.55,55.55
EXP_CSN  (via drill 0.33)
  Top 0.254: v31.82,47.42 31,48.24 IC2.44 | v42.99,47.42 42.99,45.49 v43.2,45.29
  Bottom 0.254: v31.82,47.42 35.27,47.42 35.58,47.12 39.03,47.12 40.86,48.95 41.47,48.95 v42.99,47.42 | v43.2,45.29 44.31,45.29 52.54,53.52 52.54,58.6 50.82,60.33 J2.5
EXP_MISO  (via drill 0.33)
  Top 0.254: v36.08,49.76 35.47,49.76 33.54,47.83 33.54,46.51 IC2.2
  Bottom 0.254: v36.08,49.76 41.98,49.76 45.23,53.01 48.48,53.01 50.71,55.25 J2.1
EXP_MOSI  (via drill 0.33)
  Top 0.254: v35.88,50.88 32.73,47.73 32.73,46.51 IC2.1
  Bottom 0.254: v35.88,50.88 37.1,50.88 44.01,57.79 48.17,57.79 J2.4
EXP_SCK  (via drill 0.33)
  Top 0.254: v39.03,44.38 35.68,44.38 34.36,45.7 34.36,46.41 IC2.3
  Bottom 0.254: v39.03,44.38 41.26,44.38 50.82,53.93 51.22,53.93 52.03,54.74 52.03,56.57 50.82,57.79 J2.3
FLASH_P_ENN  (via drill 0.33)
  Top 0.254: v19.01,26.09 21.15,26.09 22.27,27.21 23.69,27.21 U1.51
  Bottom 0.254: v19.01,26.09 19.01,27.1 27.65,35.74 27.65,45.19 JP1.2
FTDI_TO_ATMEGA  (via drill 0.33)
  Top 0.254: v34.97,52.1 35.68,52.1 39.03,48.74 39.03,46.51 IC2.9
  Bottom 0.254: v34.97,52.1 32.93,52.1 31,54.03 20.74,54.03 4.89,38.18 4.89,32.79 3.77,31.68 JP8.4
GND  (via drill 0.33)
  Top 0.254: 53.86,32.08 52.75,32.08 51.93,31.27 47.77,31.27 U1.20 | 53.86,32.08 54.07,32.08 | 54.07,32.08 54.68,32.08 C5.2 | 54.07,32.08 54.07,36.25 49.09,41.23 47.77,41.23 U1.30 | 54.78,22.33 54.78,26.39 C7.2 | 54.78,22.33 54.78,21.11 C13.2 | 49.6,22.33 47.77,22.33 U1.11 | 49.6,22.33 54.78,22.33 | 49.6,22.33 49.6,16.34 | 49.6,16.34 49.6,12.78 49.09,12.27 47.77,12.27 U1.1 | 53.86,32.08 53.86,27.31 54.68,26.5 C7.2 | 25.62,34.93 25.62,35.74 25.11,36.25 23.79,36.25 U1.42 23.69,36.35 22.27,36.35 21.86,36.76 21.86,40.72 23.59,42.45 23.69,42.45 | 25.62,34.93 25.62,22.74 25.21,22.33 23.79,22.33 U1.56 | U1.34 31.71,42.24 31.71,40.92 25.72,34.93 25.62,34.93 | LED3.C 48.28,48.34 48.28,49.96 LED2.C 48.17,50.07 48.17,50.47 44.72,53.93 C8.1 44.72,54.03 44.21,54.03 43.3,53.11 42.59,53.11 IC2.18 42.48,53.11 40.96,53.11 36.79,57.28 36.79,57.99 IC2.28 36.69,58.09 36.69,58.8 36.29,59.21 35.98,59.21 33.95,61.24 C12.2 33.85,61.14 33.44,60.73 33.44,60.63 33.04,60.23 32.43,60.23 30.7,61.95 30.7,63.88 JP9.10 | J3.10 19.42,11.86 v21.45,11.86 23.38,11.86 23.69,12.17 U1.66 | U3.15 59.55,25.28 59.55,27.1 59.76,27.31 U3.PAD | U3.PAD 59.86,27.41 61.08,28.63 61.08,29.34 U3.1 61.18,29.34 v61.79,29.34 | U3.19 61.89,25.99 61.38,25.99 59.96,27.41 U3.PAD | 61.13,36.71 61.69,37.26 U6.9 61.79,37.37 61.79,37.87 U6.10 61.79,37.98 61.79,38.48 U6.11 61.79,38.69 61.79,39.2 U6.12 | 61.13,36.71 60.77,36.35 U6.8 | U6.13 60.77,40.21 61.69,39.3 U6.12 | 56.45,42.8 55.79,42.14 C14.2 | 56.45,42.8 56.91,43.26 57.32,43.26 U2.5 | U4.2 60.87,19.59 60.87,17.55 60.67,17.35 C3.2 | 36.69,46.51 IC2.6 36.69,46.41 v36.69,45.09
  Top 0.254: 30.9,52.3 IC2.39 30.8,52.3 29.68,52.3 v29.58,52.2 | C1.2 13.63,28.22 13.63,19.69 9.77,15.83 9.77,15.32 JP7.1 | v27.75,50.27 27.75,51.39 C9.1 | v64.73,25.28 C6.2 | C11.2 42.99,61.34 42.99,61.75 40.86,63.88 JP9.2 | C4.C 8.04,40.21 4.69,40.21 3.77,39.3 JP8.1 | C3.2 60.98,17.55 63.52,17.55 63.72,17.35 JP4.1 | v56.81,42.45 56.45,42.8 | 61.13,36.71 63.52,34.32 J1.NEG | 23.69,42.45 23.69,43.26 21.76,45.19 JP1.8 | 23.69,42.45 23.69,41.33 U1.37 | U6.12 61.89,39.2 64.12,39.2 64.63,39.7 64.63,41.02 63.82,41.84 63.82,42.04 C15.2 63.97,42.35 v63.97,44.22 63.97,44.33 63.52,44.78 | 49.6,16.34 59.55,16.34 60.47,17.25 C3.2 | U3.11 55.84,26.56 55.84,25.94 54.73,25.94 C7.2 | U2.12 60.47,44.78 63.52,44.78 | 63.52,44.78 63.58,44.84 C2.2 | U2.10 61.25,43.8 v62.04,43.01 | U3.8 56.77,28.06 56.61,28.22 56.61,28.98 v57.37,29.75
  GND 0.254: 63.97,43.97 v63.97,44.22 63.97,43.21 63.46,42.7 62.19,42.7 62.04,42.85 v62.04,43.01 | v57.37,29.75 57.62,30
  Bottom 0.254: JP5.1 19.42,6.28 16.58,6.28 9.77,13.08 9.77,15.22 JP7.1
  pour GND (isolate 0.406): 8.73,10.25 61.73,10.25 64.23,12.75 68.73,20.25 71.23,31.25 69.98,43 65.98,51.75 55.98,62.25 43.73,67.75 29.48,68.25 20.98,65.5 12.73,60.75 4.98,52 0.48,40 -0.02,28.5 3.73,17.25 7.23,11.75
GYRO_INT2  (via drill 0.33)
  Top 0.254: v59.35,35.13 59.35,36.25 U6.6 | v32.32,48.34 31.61,49.05 IC2.43
  VCC 0.254: v32.32,48.34 v37.71,42.95
  Bottom 0.254: v59.35,35.13 54.17,35.13 46.34,42.95 v37.71,42.95
HUMID_VCC  (via drill 0.33)
  Top 0.254: v45.63,51.28 46.65,51.28 47.16,50.78 47.16,45.29 56.71,35.74 56.71,34.12 R3.2 | v41.16,52.2 37.51,52.2 34.36,55.35 31,55.35 IC2.35
  VCC 0.254: v45.63,51.28 44.72,52.2 v41.16,52.2
I2C_SCL  (via drill 0.33)
  Top 0.254: 65.65,32.59 65.65,46.71 59.35,53.01 51.02,53.01 50.71,52.71 | 65.65,32.59 65.65,25.17 62.3,21.82 60.98,21.82 U4.4 | 50.71,52.71 50.71,51.39 51.63,50.47 R1.1 | v58.84,38.18 58.54,38.48 57.83,38.48 U6.2 | v60.37,35.13 62.91,32.59 62.96,32.59 | 65.65,32.59 62.96,32.59 | v41.16,53.93 42.48,53.93 IC2.19 | v47.77,53.72 49.6,53.72 50.61,52.71 50.71,52.71 | U3.3 60.04,29.43 60.04,31.96 62.32,31.96 62.96,32.59 | U2.4 55.84,43.79 | 55.84,43.79 55.57,43.79 | 55.84,43.79 v55.84,43.46
  Bottom 0.254: v60.37,35.13 58.84,36.66 v58.84,38.18 58.64,38.13 57.11,38.13 56.86,37.87 56.35,37.87 55.84,38.38 v55.84,43.46 | v41.16,53.93 47.56,53.93 v47.77,53.72
I2C_SDA  (via drill 0.33)
  Top 0.254: 57.11,37.87 57.72,37.87 U6.3 | 56.86,37.62 56.81,37.57 56.81,36.35 59.55,33.61 59.55,31.02 59.55,30.51 | 56.86,37.62 57.11,37.87 | 59.55,30.51 59.55,29.44 U3.4 | U4.5 57.93,21.82 57.93,24.67 v56.61,24.67 | v58.33,41.63 58.33,42.65 U2.6 | v56.61,38.59 56.61,38.28 57.01,37.87 57.11,37.87 | 53.76,49.56 53.76,40.72 56.86,37.62 | 53.76,49.56 53.76,50.37 R2.1 | 53.76,49.56 50.92,49.56 45.43,55.04 44.11,55.04 43.8,54.74 42.59,54.74 IC2.20 | v56.61,30.51 59.55,30.51
  Bottom 0.254: v58.33,41.63 58.33,40.31 v56.61,38.59 | v56.61,24.67 v56.61,30.51
IPCS_MISO
  Top 0.254: JP1.5 23.79,47.32 24.3,47.32 25.31,48.34 29.28,48.34 33.85,43.77 38.22,43.77 39.64,42.34 U1.33
IPCS_MOSI
  Top 0.254: JP1.4 25.82,45.19 26.33,45.19 27.35,44.17 28.16,44.17 28.36,44.38 29.99,44.38 30.7,43.66 30.7,42.34 U1.35
IPCS_SCK  (via drill 0.33)
  Top 0.254: v28.67,43.66 28.87,43.66 29.68,42.85 29.68,42.34 U1.36
  Bottom 0.254: v28.67,43.66 28.77,43.77 28.77,47.73 28.16,48.34 27.35,48.34 26.33,47.32 25.82,47.32 JP1.3
IPCS_SSN  (via drill 0.33)
  Top 0.254: v29.48,45.49 27.75,47.22 JP1.1 | v28.77,42.75 28.56,42.75 25.11,39.3 23.79,39.3 U1.39
  Bottom 0.254: v29.48,45.49 29.48,43.46 v28.77,42.75
LED1
  Top 0.254: LED2.A 46.14,49.96 42.69,49.96 42.59,49.86 IC2.14
LED2
  Top 0.254: IC2.13 43.91,49.05 44.62,48.34 46.14,48.34 LED3.A
LIGHT_INT  (via drill 0.33)
  Top 0.254: v59.04,21.41 58.33,20.7 58.03,20.7 U4.6 | v34.56,59.41 34.56,59.01 34.36,58.8 34.36,58.09 IC2.31
  Bottom 0.254: v59.04,21.41 59.04,32.79 61.08,34.83 61.08,49.76 53.05,57.79 53.05,59.82 51.22,61.65 47.06,61.65 41.37,55.96 38.01,55.96 v34.56,59.41
MOTE_API_RX  (via drill 0.33)
  Top 0.254: v41.16,48.24 42.48,48.24 IC2.12 | v19.73,26.8 17.49,26.8 16.58,25.89 J3.3 16.58,25.78 16.58,24.46 18,23.04 18.2,23.04 21.96,19.28 23.69,19.28 U1.59
  Bottom 0.254: v19.73,26.8 v41.16,48.24
MOTE_API_TX  (via drill 0.33)
  Top 0.254: v40.66,45.09 40.66,46.41 IC2.11 | v21.66,27.71 19.42,27.71 19.32,27.82 J3.2 | v21.66,16.34 23.69,16.34 U1.62
  Bottom 0.254: v40.66,45.09 38.72,45.09 22.32,28.68 | 22.32,28.68 21.66,28.02 v21.66,27.71 | v21.66,16.34 21.66,22.23 22.37,22.94 22.37,28.63 22.32,28.68
MOTE_CLI_RX  (via drill 0.33)
  Top 0.254: v34.15,43.06 36.59,43.06 39.23,40.41 40.25,40.41 40.66,40.82 40.66,42.24 U1.32
  Bottom 0.254: v34.15,43.06 28.36,48.85 27.14,48.85 26.84,48.54 19.52,48.54 18.71,47.73 18.71,46.81 19.73,45.8 19.73,45.29 JP1.10
MOTE_CLI_TX  (via drill 0.33)
  Top 0.254: v21.25,49.25 19.83,47.83 19.83,47.32 JP1.9 | v33.24,42.65 33.54,42.65 36.29,39.91 40.76,39.91 41.67,40.82 41.67,42.24 U1.31
  Bottom 0.254: v21.25,49.25 26.84,49.25 26.94,49.35 28.87,49.35 34.86,43.36 34.86,42.75 34.46,42.34 33.54,42.34 v33.24,42.65
MOTE_RADIO_INHIBIT  (via drill 0.33)
  Top 0.254: v14.34,53.42 16.07,53.42 21.86,59.21 33.04,59.21 33.44,58.8 33.44,58.09 IC2.32 | v13.22,15.42 17.69,15.42 18.81,14.3 23.69,14.3 U1.64
  Bottom 0.254: v14.34,53.42 2.56,41.63 2.56,26.09 v13.22,15.42
MOTE_RESETN  (via drill 0.33)
  Top 0.254: v16.58,23.45 16.58,21.92 J3.5 16.47,21.82 12.51,17.86 12.51,10.34 13.83,9.02 15.56,9.02 16.68,10.14 23.99,10.14 34.56,20.7 40.25,20.7 45.74,26.19 47.67,26.19 U1.15
  Bottom 0.254: v16.58,23.45 16.58,38.08 23.69,45.19 JP1.6
MOTE_RX_CTSN  (via drill 0.33)
  Top 0.254: v28.87,52.81 28.87,51.9 29.28,51.49 30.9,51.49 IC2.40 | v20.34,22.33 22.37,20.3 23.69,20.3 U1.58
  Bottom 0.254: v28.87,52.81 26.43,52.81 25.11,51.49 21.05,51.49 11.19,41.63 11.19,27.82 16.68,22.33 v20.34,22.33
MOTE_RX_RTSN  (via drill 0.33)
  Top 0.254: v43.91,50.68 42.59,50.68 IC2.15 | v43.91,48.03 43.91,28.32 40.25,24.67 40.05,24.67 38.62,23.24 38.62,21.92 J4.16 38.42,21.82 37.91,21.31 23.79,21.31 U1.57
  Bottom 0.254: v43.91,48.03 v43.91,50.68
MOTE_SLEEPN  (via drill 0.33)
  Top 0.254: v2.56,25.07 2.56,41.63 7.23,46.31 9.67,46.31 21.35,57.99 32.63,57.99 IC2.33 | v13.22,14.4 15.97,14.4 16.47,13.9 J3.9 | v49.8,38.18 47.77,38.18 U1.27
  Bottom 0.254: v2.56,25.07 v13.22,14.4 21.35,14.4 45.13,38.18 v49.8,38.18
MOTE_TIMEN  (via drill 0.33)
  Top 0.254: v9.36,41.63 9.36,44.88 10.48,46 13.73,46 23.99,56.26 30.9,56.26 IC2.34 | v21.35,15.42 23.59,15.42 23.69,15.32 U1.63
  Bottom 0.254: v9.36,41.63 9.36,35.84 9.57,35.64 9.57,27.71 9.36,27.51 9.36,24.67 18.61,15.42 v21.35,15.42
MOTE_TX_CTSN  (via drill 0.33)
  Top 0.254: v32.32,51.69 32.32,51.28 31.71,50.68 31,50.68 IC2.41 | v18.3,17.45 23.59,17.45 23.69,17.35 U1.61
  Bottom 0.254: v32.32,51.69 31.1,51.69 29.28,53.52 20.94,53.52 10.07,42.65 10.07,27.51 9.87,27.31 9.87,25.89 v18.3,17.45
MOTE_TX_RTSN  (via drill 0.33)
  Top 0.254: v24.81,52.2 27.45,49.56 28.06,49.56 28.26,49.76 30.9,49.76 IC2.42 | v20.94,19.08 21.45,19.08 22.27,18.27 23.69,18.27 U1.60
  Bottom 0.254: v24.81,52.2 21.05,52.2 10.68,41.84 10.68,25.99 17.59,19.08 v20.94,19.08
N$1
  Top 0.254: U3.10 55.59,27.06 55.59,27.97 54.73,27.97 C7.1
N$2
  Top 0.254: U6.14 60.06,40.31 60.06,40.82 60.37,41.12 63.01,41.12 63.72,40.41 C15.1
N$3
  Top 0.254: R3.1 56.71,32.39 54.78,30.46 C5.1 54.73,30 56.1,30 56.1,27.56 U3.9
N$6
  Top 0.254: C11.1 39.74,61.24 X2.2 39.74,61.14 39.13,60.53 39.13,58.09 IC2.25
N$7
  Top 0.254: C12.1 35.68,61.24 37.2,61.24 X2.1 37.2,61.14 38.32,60.02 38.32,58.09 IC2.26
PIR_OUT  (via drill 0.33)
  Top 0.254: v34.97,53.72 37.2,51.49 42.48,51.49 IC2.16
  Bottom 0.254: v34.97,53.72 33.04,53.72 31.92,54.84 26.33,54.84 21.96,59.21 20.23,59.21 U5.OUT
PIR_VCC
  Top 0.254: IC2.30 35.07,57.99 35.07,57.28 34.66,56.87 22.88,56.87 22.77,56.77 U5.VDD
RST  (via drill 0.33)
  Top 0.254: C10.1 8.14,26.7 10.38,26.7 R4.1 10.38,26.8 v11.9,28.32 | v35.17,48.44 35.17,46.51 IC2.4 | v32.73,60.94 32.73,61.65 33.44,62.36 34.76,62.36 35.68,63.27 35.68,63.88 JP9.6
  Bottom 0.254: 35.17,50.98 35.17,51.28 35.68,51.79 35.68,57.28 32.73,60.23 v32.73,60.94 | 35.17,50.98 v35.17,48.44 | v11.9,28.32 11.9,41.63 21.25,50.98 35.17,50.98
RTS#
  Top 0.254: C10.2 6.31,26.7 3.88,26.7 3.77,26.6 JP8.6
TCK
  Top 0.254: IC2.21 42.59,55.45 43.2,55.45 44.01,56.26 44.01,64.09 41.67,66.42 40.86,66.42 JP9.1
TDI  (via drill 0.33)
  Top 0.254: v39.84,56.67 39.84,57.99 IC2.24
  Bottom 0.254: v39.84,56.67 38.32,56.67 32.32,62.66 30.09,62.66 29.28,63.48 29.28,65.1 30.6,66.42 JP9.9
TDO  (via drill 0.33)
  Top 0.254: v40.76,59.41 40.76,58.09 IC2.23
  VCC 0.254: v41.77,65.31 41.67,65.41 40.35,65.41 39.03,66.73 38.52,66.73 38.32,66.53 JP9.3
  Bottom 0.254: v40.76,59.41 40.76,62.05 42.08,63.38 42.08,65 v41.77,65.31
TMS  (via drill 0.33)
  Top 0.254: v41.57,57.18 42.48,56.26 IC2.22
  VCC 0.254: v34.46,63.07 34.46,66.42 35.68,66.42 JP9.5
  Bottom 0.254: v41.57,57.18 40.76,57.18 35.27,62.66 34.86,62.66 v34.46,63.07
VBATT
  Top 0.254: R5.2 11.7,43.36 11.7,40.62 11.39,40.31 C4.A 11.29,40.21 11.29,37.67 7.94,34.32 J1.POS
VCC  (via drill 0.33)
  Top 0.254: 58.38,36.71 58.74,36.35 U6.5 | 58.38,36.71 57.83,37.26 U6.4 | U6.1 57.83,39.3 58.74,40.21 U6.16 | 59.15,40.31 58.84,40.31 U6.16 | 59.15,40.31 59.35,40.31 U6.15 59.45,40.21 59.55,40.11 59.55,37.87 58.38,36.71 | C14.1 55.79,40.31 v57.22,40.31 58.64,40.31 U6.16 | R1.2 51.73,52.1 53.66,52.1 R2.2 53.76,52 54.07,52 59.91,46.15 | 59.15,42.75 59.35,42.75 U2.8 59.45,42.85 59.45,45.8 U2.14 59.55,45.8 59.91,46.15 | 59.15,42.75 58.94,42.75 U2.7 | 59.91,46.15 60.98,47.22 61.79,47.22 C2.1 | 59.15,42.75 59.15,40.31 | U4.1 58.03,19.59 v58.03,18.67 58.03,18.16 58.84,17.35 C3.1 | C13.1 54.78,19.38 57.93,19.38 U4.1 | C6.1 64.63,28.02 62.8,26.19 62.8,24.97 59.76,21.92 59.76,21.11 58.13,19.48 U4.1 | 16.58,29.85 J3.1 16.47,29.95 13.73,29.95 C1.1 12.72,29.04 12.72,27.21 v11.6,26.09 10.48,24.97 R4.2 | IC2.17 42.59,52.3 44.72,52.3 C8.2 44.62,52.2 v44.62,51.28 | v10.58,45.09 11.7,45.09 R5.1 | IC2.38 30.9,53.11 29.68,53.11 29.28,53.52 28.56,53.52 28.16,53.11 27.75,53.11 C9.2 27.65,53.01 24.6,53.01 22.67,51.08 v22.67,46.41 | v35.88,47.83 35.88,46.51 IC2.5 | v37.51,59.41 37.51,58.09 IC2.27 | v21.66,23.24 23.69,23.24 U1.55
  VCC 0.254: v22.67,46.41 22.27,46.41 22.27,47.83 22.06,47.83 22.06,48.14 22.13,48.23
  pour VCC (isolate 0.406): 8.73,10.25 61.73,10.25 64.23,12.75 68.73,20.25 71.23,31.25 69.98,43 65.98,51.75 55.98,62.25 43.73,67.75 29.48,68.25 20.98,65.5 12.73,60.75 4.98,52 0.48,40 -0.02,28.5 3.73,17.25 7.23,11.75

### Text on the board
tNames: JTAG | EXP | FTDI | U4 | COVER BEFORE / SOLDERING / DUST MOTE
bNames: NEGATIVE | POSITIVE | Dust Sensor PCB / Kevin Weekly